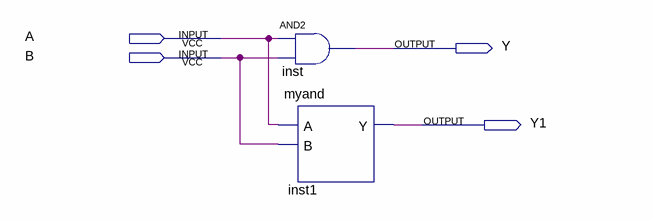
[diagram p0: schematic sheet]
// Quartus schematic myproject.bdf as structural Verilog: 2 symbols, 4 pins
module myproject (
  input  A,
  input  B,
  output Y,
  output Y1
);

  and inst (Y, A, B);
  myand inst1 (.A(A), .B(B), .Y(Y1));
endmodule
